# Altium schematic sheet IRF7455 IC.SchDoc
size A4
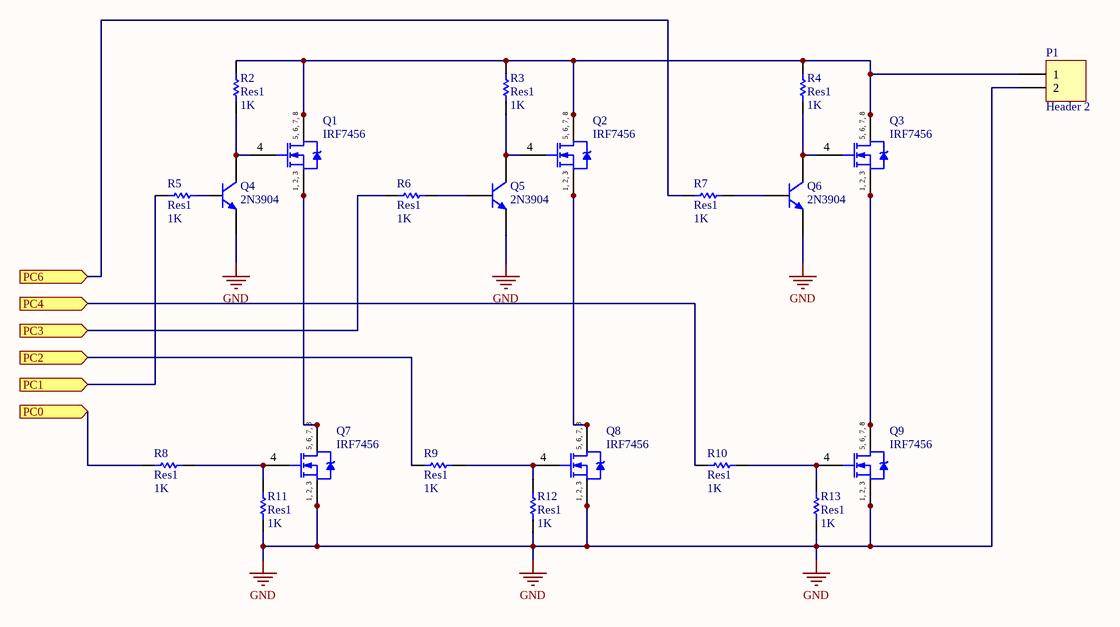
[diagram p0: IRF7455 IC.SchDoc]

## Parts
P1  Header 2  [HDR1X2]
Q1  IRF7456  [SO-8_N]
Q2  IRF7456  [SO-8_N]
Q3  IRF7456  [SO-8_N]
Q4  2N3904  [TO-92A]
Q5  2N3904  [TO-92A]
Q6  2N3904  [TO-92A]
Q7  IRF7456  [SO-8_N]
Q8  IRF7456  [SO-8_N]
Q9  IRF7456  [SO-8_N]
R2  Res1  value 1K  [AXIAL-0.3]
R3  Res1  value 1K  [AXIAL-0.3]
R4  Res1  value 1K  [AXIAL-0.3]
R5  Res1  value 1K  [AXIAL-0.3]
R6  Res1  value 1K  [AXIAL-0.3]
R7  Res1  value 1K  [AXIAL-0.3]
R8  Res1  value 1K  [AXIAL-0.3]
R9  Res1  value 1K  [AXIAL-0.3]
R10  Res1  value 1K  [AXIAL-0.3]
R11  Res1  value 1K  [AXIAL-0.3]
R12  Res1  value 1K  [AXIAL-0.3]
R13  Res1  value 1K  [AXIAL-0.3]

## Ports
PC0 (in), PC1 (in), PC2 (in), PC3 (in), PC4 (in), PC6 (in)

## Nets
GND: P1.2 Q4.1(E) Q5.1(E) Q6.1(E) Q7.1(S) Q7.2(S) Q7.3(S) Q8.1(S) Q8.2(S) Q8.3(S) Q9.1(S) Q9.2(S) Q9.3(S) R11.1 R12.1 R13.1
PC0: R8.2 ; port PC0
PC1: R5.2 ; port PC1
PC2: R9.2 ; port PC2
PC3: R6.2 ; port PC3
PC4: R10.2 ; port PC4
PC6: R7.2 ; port PC6
NetP1_1: P1.1 Q1.5(D) Q1.6(D) Q1.7(D) Q1.8(D) Q2.5(D) Q2.6(D) Q2.7(D) Q2.8(D) Q3.5(D) Q3.6(D) Q3.7(D) Q3.8(D) R2.2 R3.2 R4.2
NetQ1_1: Q1.1(S) Q1.2(S) Q1.3(S) Q7.5(D) Q7.6(D) Q7.7(D) Q7.8(D)
NetQ1_4: Q1.4(G) Q4.3(C) R2.1
NetQ2_1: Q2.1(S) Q2.2(S) Q2.3(S) Q8.5(D) Q8.6(D) Q8.7(D) Q8.8(D)
NetQ2_4: Q2.4(G) Q5.3(C) R3.1
NetQ3_1: Q3.1(S) Q3.2(S) Q3.3(S) Q9.5(D) Q9.6(D) Q9.7(D) Q9.8(D)
NetQ3_4: Q3.4(G) Q6.3(C) R4.1
NetQ4_2: Q4.2(B) R5.1
NetQ5_2: Q5.2(B) R6.1
NetQ6_2: Q6.2(B) R7.1
NetQ7_4: Q7.4(G) R8.1 R11.2
NetQ8_4: Q8.4(G) R9.1 R12.2
NetQ9_4: Q9.4(G) R10.1 R13.2

## Notes on the sheet
- (in symbol IRF7456) 5, 6, 7, 8; 1, 2, 3

## Library data of the parts
P1 = Header 2: Header, 2-Pin; LatestRevisionDate: 17-Jul-2002; LatestRevisionNote: Re-released for DXP Platform.; Publisher: Altium Limited
Q1-Q3 Q7-Q9 = IRF7456: HEXFET Power MOSFET; Published: 17-Sep-2003; LatestRevisionDate: 13-Apr-2006; LatestRevisionNote: IPC-7351 Footprint Added.; DatasheetVersion: 20-Apr-2000; PackageVersion: Feb-2001; PackageReference: SO-8; Publisher: Altium Limited; PackageDescription: 8-Pin Plastic Small Outline Integrated Circuit 1.27 mm Pitch; Code_JEDEC: MS-012-AA; Code_IPC: SOIC127P600-8; ComponentLink1Description: Manufacturer Link; ComponentLink1URL: http://www.irf.com/; ComponentLink2Description: Datasheet; ComponentLink2URL: http://www.irf.com/product-info/datasheets/data/irf7456.pdf
Q4-Q6 = 2N3904: NPN General Purpose Amplifier; Published: 8-Jun-2000; LatestRevisionDate: 15-Jan-2003; LatestRevisionNote: PCB Footprint 'BCY-W3/D4.7' replaced; DatasheetVersion: 1997; PackageVersion: Sep-1998; PackageReference: TO-92A; Publisher: Altium Limited; PackageDescription: TO, Flat Index; 3 In-Line, Axial Leads; Body Dia. 4.5mm; Leads 0.51 x 0.48 mm (max); ComponentLink1Description: Manufacturer Link; ComponentLink1URL: http://www.fairchildsemi.com/; ComponentLink2Description: Datasheet; ComponentLink2URL: http://www.fairchildsemi.com/ds/2N%2F2N3904.pdf
R2-R13 = Res1: Resistor; Published: 8-Jun-2000; LatestRevisionDate: 17-Jul-2002; LatestRevisionNote: Re-released for DXP Platform.; PackageReference: AXIAL-0.3; Publisher: Altium Limited; PackageDescription: Axial Device, Thru-Hole; 2 Leads; 0.3 in Pin Spacing